# Altium project power regulator and led board.PrjPcb
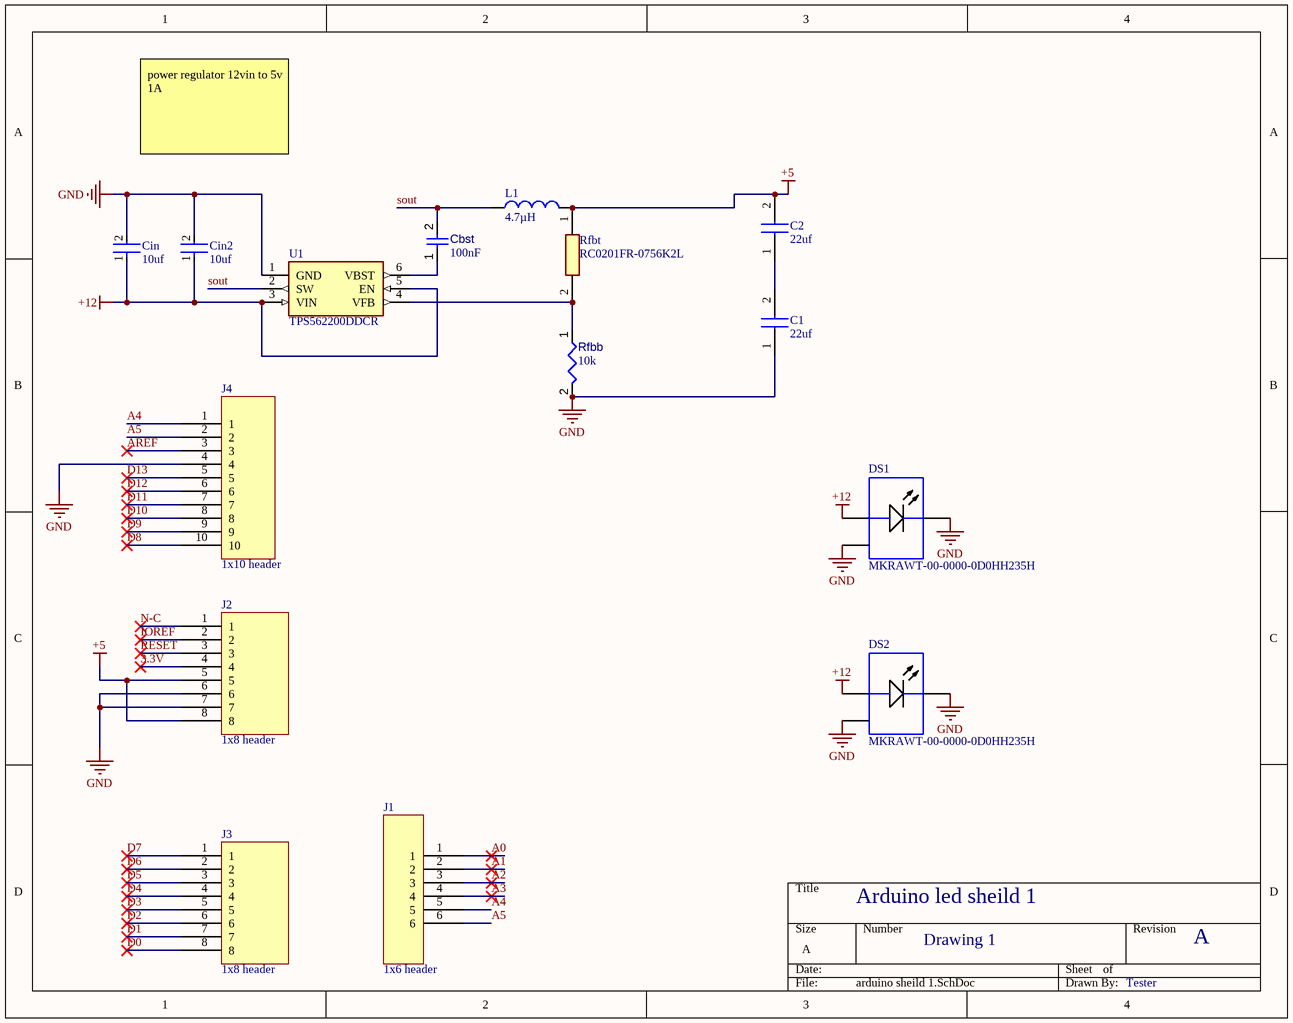
[diagram p0: arduino sheild 1.SchDoc]
1 sheet, 15 parts. Net scope: global (net labels, ports and power ports of the same name join across sheets).
Board file: PCB1.PcbDoc

## Sheet arduino sheild 1.SchDoc
size A; SheetNumber: 1; SheetTotal: 1

### Parts
C1  22uf  [CAPC2114X95N]
C2  22uf  [CAPC2114X95N]
Cbst  value 100nF  [CAPC2012X75N]  (hidden comment: 08053C104KAT2A)
Cin  10uf  [FP-GRM21B-0_15-IPC_C]
Cin2  10uf  [FP-GRM21B-0_15-IPC_C]
DS1  MKRAWT-00-0000-0D0HH235H  [CREE-MK-R-2_V]
DS2  MKRAWT-00-0000-0D0HH235H  [CREE-MK-R-2_V]
J1  1x6 header  [1x6 header]
J2  1x8 header  [1x8 header]
J3  1x8 header  [1x8 header]
J4  1x10 header  [1x10 pin header]
L1  value 4.7µH  [INDP6060X450N]  (hidden comment: SRN6045-4R7Y)
Rfbb  value 10k  [RESC0603X26N]  (hidden comment: RC0201FR-0710KL)
Rfbt  RC0201FR-0756K2L  [RESC0603X26N]
U1  TPS562200DDCR  [SOT95P280X110-6N]

### Nets
+5: C2.2 J2.5 J2.8 L1.2 Rfbt.1
+12: Cin.1 Cin2.1 DS1.1(A) DS2.1(A) U1.3(VIN) U1.5(EN)
GND: C1.1 Cin.2 Cin2.2 DS1.2(K) DS1.3(EP) DS2.2(K) DS2.3(EP) J2.6 J2.7 J4.4 Rfbb.2 U1.1(GND)
3.3V: J2.4
A0: J1.1
A1: J1.2
A2: J1.3
A3: J1.4
A4: J1.5 J4.1
A5: J1.6 J4.2
AREF: J4.3
D0: J3.8
D1: J3.7
D2: J3.6
D3: J3.5
D4: J3.4
D5: J3.3
D6: J3.2
D7: J3.1
D8: J4.10
D9: J4.9
D10: J4.8
D11: J4.7
D12: J4.6
D13: J4.5
IOREF: J2.2
N-C: J2.1
RESET: J2.3
sout: Cbst.2 L1.1 U1.2(SW)
NetC1_2: C1.2 C2.1
NetCbst_1: Cbst.1 U1.6(VBST)
NetRfbb_1: Rfbb.1 Rfbt.2 U1.4(VFB)

### Notes on the sheet
- power regulator 12vin to 5v 1A
- Arduino led sheild 1
- Drawing 1
- A
- Tester

### Library data of the parts
C1 C2 = MSASL219LB5226MTNA01: Capacitor; Manufacturer_Name: TAIYO YUDEN; Datasheet Link: https://4donline.ihs.com/images/VipMasterIC/IC/TAIY/TAIY-S-A0026212580/TAIY-S-A0026212609-1.pdf?hkey=61A2E4C270F0397D049F8F05BD4F1054; Height: 0.95mm; Manufacturer_Part_Number: MSASL219LB5226MTNA01
Cbst = CMP-001-00084-1: 25V 100nF X7R 卤10% 0805 Multilayer Ceramic Capacitors MLCC - SMD/SMT ROHS; Tolerance: 10%; Min Operating Temperature: -55°C; Max Operating Temperature: 125°C; Mounting Technology: Surface Mount; Pins: 2; Case/Package: 0805; Voltage Rating: 25V
Cin Cin2 = CMP-2007-03541-2: Chip Multilayer Ceramic Capacitors for General Purpose, 0805, 10uF, X5R, 15%, 10%, 25V; Length: 2mm; Depth: 1.25mm; Termination: SMD/SMT; Voltage: 25V; Height: 1.25mm; Material: Ceramic; Thickness: 0.053inch; Radiation Hardening: No; Min Operating Temperature: -55°C; Width: 0.049inch; Package Quantity: 1; Mount: Surface Mount; Dielectric: X5R; Packaging: Tape and Reel; Capacitance: 10uF; Voltage Rating (DC): 25V; Lead Free: Lead Free; Max Operating Temperature: 85°C; Case Code (Imperial): 0805; Case/Package: 0805; Tolerance: 10%; Voltage Rating: 25V; Case Code (Metric): 2012
DS1 DS2 = CMP-2100-00975-1: LED, White, 12 V, 2-Pin SMD, RoHS, Tape and Reel
J1 = 6 pin header: 1x6 pin header
J2 J3 = 8 pin header: 1x8 header pin
J4 = 10 pin header: 1x10 header pin
L1 = CMP-006-00021-2: Inductor Power Semi-Shielded Wirewound 4.7uH 30% 100KHz 15Q-Factor Ferrite 3A 0.0376Ohm DCR T/R; Self Resonant Frequency: 22MHz; Case/Package: 2424; Current Rating: 3A; Max Current Rating: 3A; Mounting Technology: Surface Mount; Min Operating Temperature: -40°C; Tolerance: 30%; Pins: 2; Max Operating Temperature: 125°C
Rfbb = CMP-009-00177-1: Res Thick Film 0201 10K Ohm 1% 0.05W(1/20W) ±200ppm/C Pad SMD T/R; Voltage Rating: 25V; Pins: 2; Tolerance: 1%; Max Operating Temperature: 125°C; Min Operating Temperature: -55°C; Case/Package: 0201; Mounting Technology: Surface Mount
Rfbt = RC0201FR-0756K2L: Resistor; Manufacturer_Name: Yageo Group; Datasheet Link: https://www.yageo.com/upload/media/product/productsearch/datasheet/rchip/PYu-RC_Group_51_RoHS_L_12.pdf; Height: 0.26mm; Manufacturer_Part_Number: RC0201FR-0756K2L; Mouser Part Number: 603-RC0201FR-0756K2L; Mouser Price/Stock: https://www.mouser.co.uk/ProductDetail/YAGEO/RC0201FR-0756K2L?qs=Q4gDqC5t5%2FD3%2Fkjmz2Nr%2Fw%3D%3D; Arrow Part Number: RC0201FR-0756K2L; Arrow Price/Stock: https://www.arrow.com/en/products/rc0201fr-0756k2l/yageo?region=nac
U1 = TPS562200DDCR: Undefined or Miscellaneous; Manufacturer_Name: Texas Instruments; Datasheet Link: http://www.ti.com/lit/gpn/tps562200; Height: 1.1mm; Manufacturer_Part_Number: TPS562200DDCR; Mouser Part Number: 595-TPS562200DDCR; Mouser Price/Stock: https://www.mouser.co.uk/ProductDetail/Texas-Instruments/TPS562200DDCR?qs=7wMBv%2Ftbz9Jdis0htpD4wA%3D%3D; Arrow Part Number: TPS562200DDCR; Arrow Price/Stock: https://www.arrow.com/en/products/tps562200ddcr/texas-instruments?utm_currency=USD&region=europe